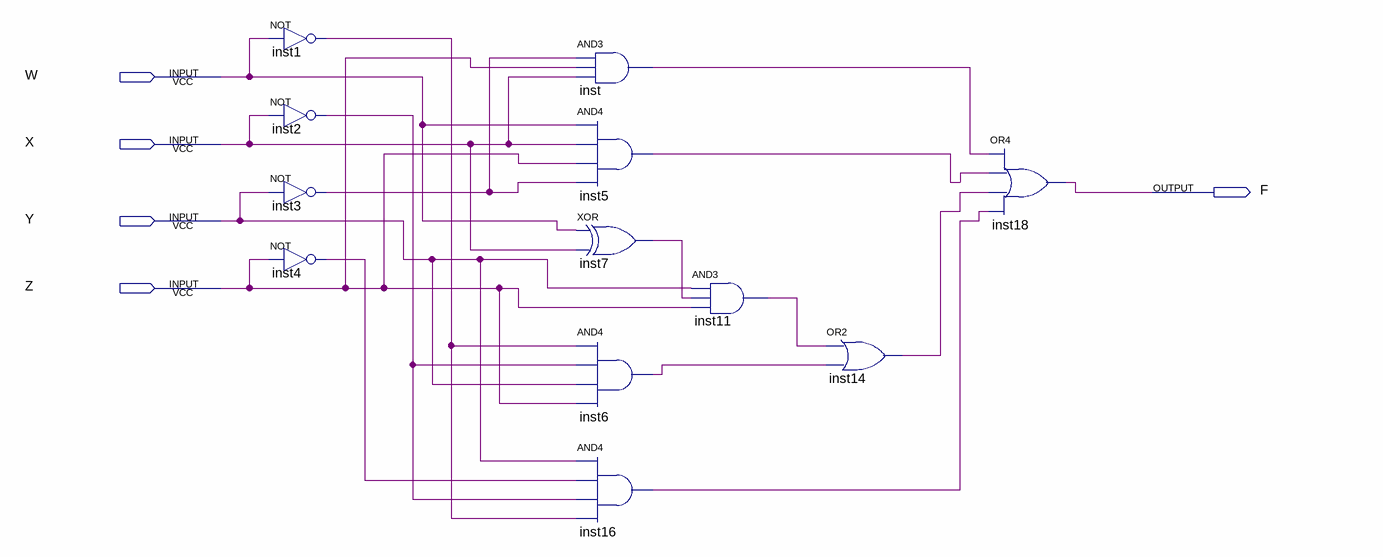
[diagram p0: schematic sheet]
// Quartus schematic BPCircuit.bdf as structural Verilog: 12 symbols, 5 pins
module BPCircuit (
  input  W,
  input  X,
  input  Y,
  input  Z,
  output F
);

  wire inst1_out, inst2_out, inst3_out, inst4_out, inst5_out, inst6_out, inst7_out, inst11_out, inst14_out,
       inst16_out, inst_out;

  not inst1 (inst1_out, W);
  not inst2 (inst2_out, X);
  not inst3 (inst3_out, Y);
  not inst4 (inst4_out, Z);
  and inst (inst_out, inst3_out, Z, X);
  and inst5 (inst5_out, W, X, Z, inst3_out);
  xor inst7 (inst7_out, W, X);
  and inst6 (inst6_out, inst1_out, inst2_out, Y, Z);
  and inst16 (inst16_out, Y, inst4_out, inst2_out, inst1_out);
  and inst11 (inst11_out, Y, inst7_out, Z);
  or inst14 (inst14_out, inst11_out, inst6_out);
  or inst18 (F, inst_out, inst5_out, inst14_out, inst16_out);
endmodule
